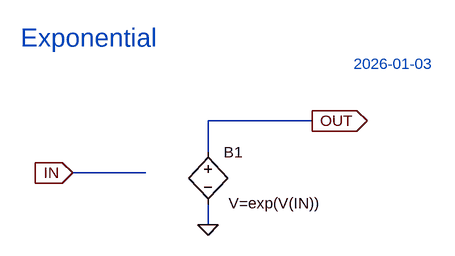
[diagram p0: schematic EXP.asc]
EXP.asc, the LTspice schematic file:
Version 4.1
SHEET 1 2212 872
WIRE -784 -704 -944 -704
WIRE -944 -656 -944 -704
WIRE -1040 -624 -1152 -624
WIRE -944 -544 -944 -576
FLAG -944 -544 0
FLAG -1152 -624 IN
IOPIN -1152 -624 In
FLAG -784 -704 OUT
IOPIN -784 -704 Out
SYMBOL bv -944 -672 R0
WINDOW 3 32 95 Left 2
SYMATTR Value V=exp(V(IN))
SYMATTR InstName B1
TEXT -720 -792 Left 2 ;2026-01-03
TEXT -1232 -832 Left 4 ;Exponential

The netlist it stands for:
* EXP.asc
B1 OUT 0 V=exp(V(IN))
* 2026-01-03
* Exponential
.backanno
.end